# EAGLE design MT7687_Breakout (EAGLE 7.6.0)
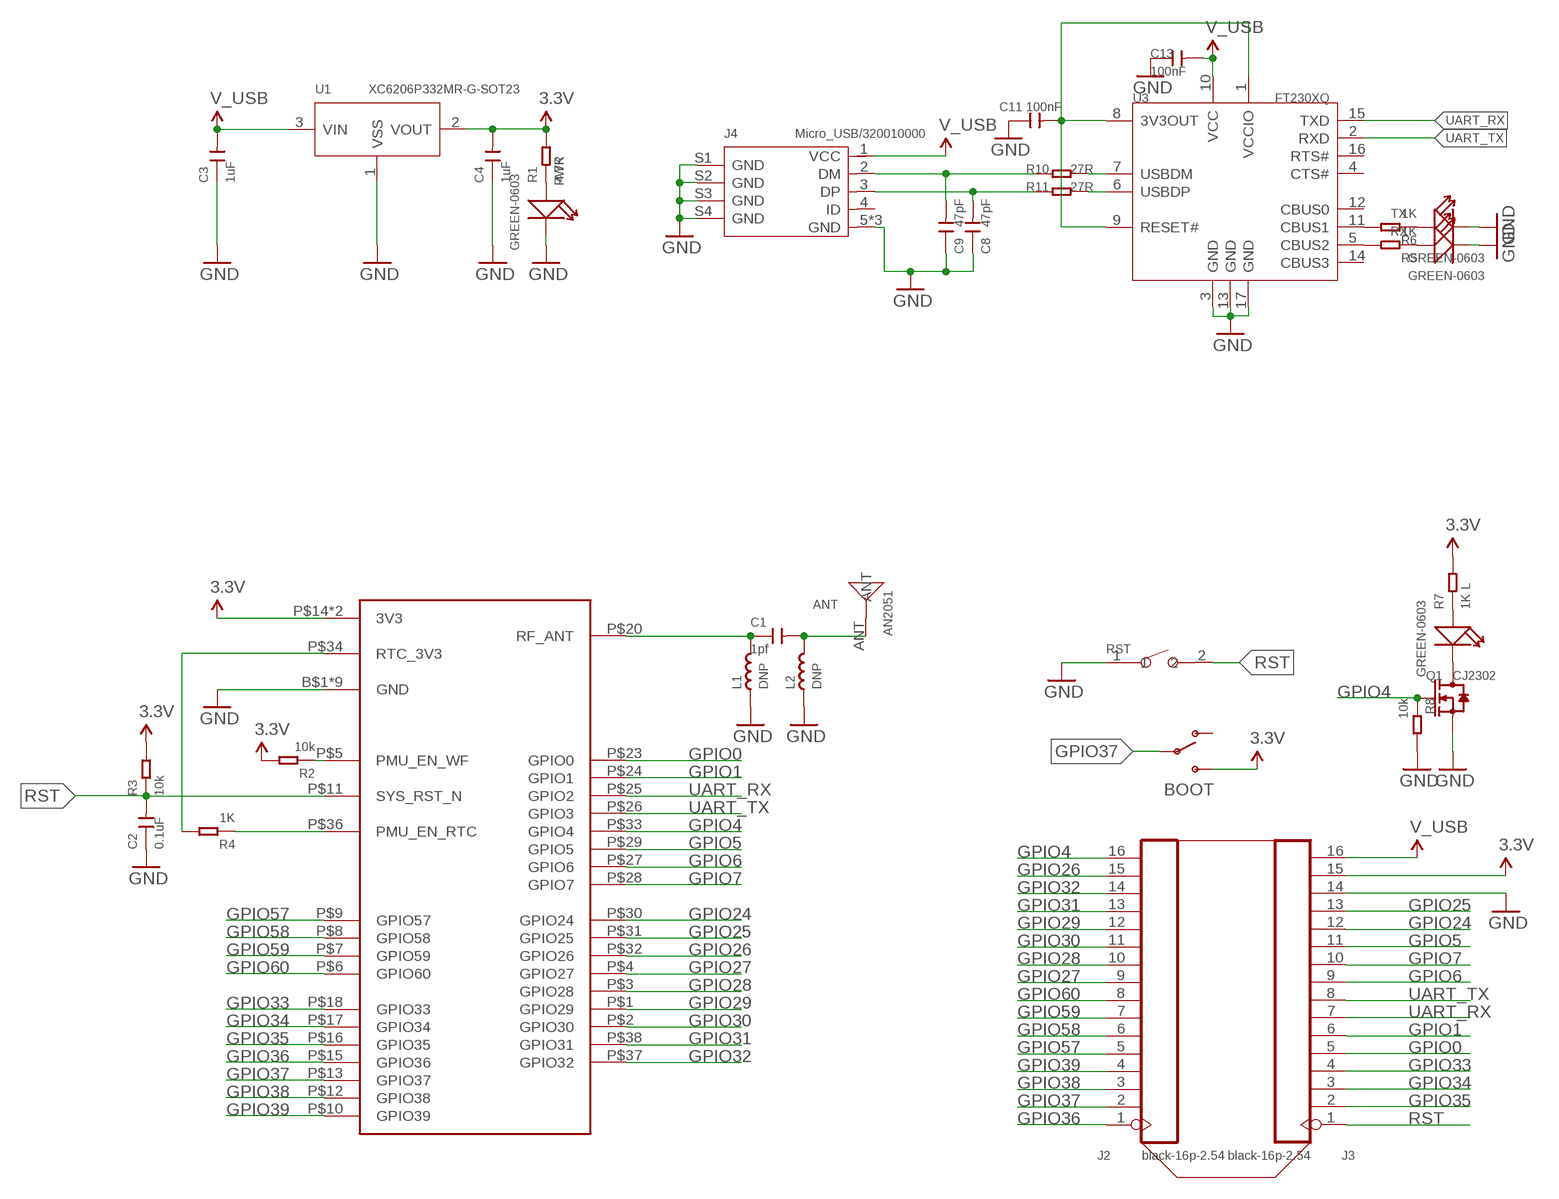
[diagram p0: schematic, sheet 1]

## Parts
ANT  AN2051  ANTENNA-AN2051-2.4G  [ANT-SMD2P-5.05X2X1.07MM]
BOOT  SWITCH-SPDTSMD  [AYZ0202]
C1  1pf  CERAMIC-1PF-50V-0.1PF-NPO(0402)  [C0402]
C2  0.1uF  CAP-0402  [C0402]
C3  1uF  CAP-0402  [C0402]
C4  1uF  CAP-0402  [C0402]
C8  47pF  CAP-0402  [C0402]
C9  47pF  CAP-0402  [C0402]
C11  100nF  CAP-0402  [C0402]
C13  100nF  CAP-0402  [C0402]
J2  black-16p-2.54  DIP-BLACK-FEMALE-HEADER-VERT(16P-2.54)  [H16-2.54]
J3  black-16p-2.54  DIP-BLACK-FEMALE-HEADER-VERT(16P-2.54)  [H16-2.54]
J4  Micro_USB/320010000  USB-MICRO-5P'5+4P'  [5+4P-SMD-0.65-B]
L  GREEN-0603  SMD-LED-CLEAR-GREEN(0603)  [LED-0603]
L1  DNP  INDUCTOR/FERRITE-BEAD'0402'  [L0402]
L2  DNP  INDUCTOR/FERRITE-BEAD'0402'  [L0402]
PWR  GREEN-0603  SMD-LED-CLEAR-GREEN(0603)  [LED-0603]
Q1  CJ2302  SMD-MOSFET-N-CH-20V-2.1A-CJ2302(SOT-23)  [SOT-23]
R1  4.7K  RES-0402  [R0402]
R2  10k  RES-0402  [R0402]
R3  10k  RES-0402  [R0402]
R4  1K  RES-0402  [R0402]
R5  1K  RES-0402  [R0402]
R6  1K  RES-0402  [R0402]
R7  1K  RES-0402  [R0402]
R8  10k  RES-0402  [R0402]
R10  27R  RES-0402  [R0402]
R11  27R  RES-0402  [R0402]
RST  SMD-BUTTON(2P-6.0X3.0X2.5MM)-DHT-1163S  [SW2-4.0-6.0X3.0X2.5MM]
RX  GREEN-0603  SMD-LED-CLEAR-GREEN(0603)  [LED-0603]
TX  GREEN-0603  SMD-LED-CLEAR-GREEN(0603)  [LED-0603]
U1  XC6206P332MR-G-SOT23  PMIC-LDO-XC6206P332MR-G(SOT23)  [SOT-23]
U3  FT230XQ  [QFN-16]
U$1  MT7687  [MT7687]

## Nets
3.3V: BOOT.3(S) C4.2 J3.15 R1.2 R2.2 R3.2 R7.2 U1.2(VOUT) U$1.P$14(3V3) U$1.P$39(3V3)
GND: C2.1 C3.1 C4.1 C8.1 C9.1 C11.1 C13.1 J3.14 J4.5(GND) J4.S1(GND) J4.S2(GND) J4.S3(GND) J4.S4(GND) J4.S5(GND) J4.S6(GND) L1.1 L2.1 PWR.- Q1.2(S) R8.2 RST.1 RX.- TX.- U1.1(VSS) U3.3(GND) U3.13(GND) U3.17(GND) U$1.B$1(GND) U$1.B$2(GND) U$1.B$3(GND) U$1.B$4(GND) U$1.P$19(GND) U$1.P$21(GND) U$1.P$22(GND) U$1.P$35(GND) U$1.P$40(GND)
GPIO0: J3.5 U$1.P$23(GPIO0)
GPIO1: J3.6 U$1.P$24(GPIO1)
GPIO4: J2.16 Q1.1(G) R8.1 U$1.P$33(GPIO4)
GPIO5: J3.11 U$1.P$29(GPIO5)
GPIO6: J3.9 U$1.P$27(GPIO6)
GPIO7: J3.10 U$1.P$28(GPIO7)
GPIO24: J3.12 U$1.P$30(GPIO24)
GPIO25: J3.13 U$1.P$31(GPIO25)
GPIO26: J2.15 U$1.P$32(GPIO26)
GPIO27: J2.9 U$1.P$4(GPIO27)
GPIO28: J2.10 U$1.P$3(GPIO28)
GPIO29: J2.12 U$1.P$1(GPIO29)
GPIO30: J2.11 U$1.P$2(GPIO30)
GPIO31: J2.13 U$1.P$38(GPIO31)
GPIO32: J2.14 U$1.P$37(GPIO32)
GPIO33: J3.4 U$1.P$18(GPIO33)
GPIO34: J3.3 U$1.P$17(GPIO34)
GPIO35: J3.2 U$1.P$16(GPIO35)
GPIO36: J2.1 U$1.P$15(GPIO36)
GPIO37: BOOT.2(P) J2.2 U$1.P$13(GPIO37)
GPIO38: J2.3 U$1.P$12(GPIO38)
GPIO39: J2.4 U$1.P$10(GPIO39)
GPIO57: J2.5 U$1.P$9(GPIO57)
GPIO58: J2.6 U$1.P$8(GPIO58)
GPIO59: J2.7 U$1.P$7(GPIO59)
GPIO60: J2.8 U$1.P$6(GPIO60)
N$1: R2.1 U$1.P$5(PMU_EN_WF)
N$2: C1.1 L1.2 U$1.P$20(RF_ANT)
N$3: ANT.ANT C1.2 L2.2
N$4: PWR.+ R1.1
N$5: R4.1 U$1.P$36(PMU_EN_RTC)
N$6: L.+ R7.1
N$7: C11.2 U3.1(VCCIO) U3.8(3V3OUT) U3.9(RESET#)
N$8: L.- Q1.3(D)
N$9: R4.2 U$1.P$34(RTC_3V3)
N$10: R10.2 U3.7(USBDM)
N$12: R11.2 U3.6(USBDP)
N$15: C9.2 J4.2(DM) R10.1
N$16: C8.2 J4.3(DP) R11.1
N$36: R5.1 RX.+
N$37: R6.1 TX.+
N$38: R5.2 U3.5(CBUS2)
N$39: R6.2 U3.11(CBUS1)
RST: C2.2 J3.1 R3.1 RST.2 U$1.P$11(SYS_RST_N)
UART_RX: J3.7 U3.15(TXD) U$1.P$25(GPIO2)
UART_TX: J3.8 U3.2(RXD) U$1.P$26(GPIO3)
V_USB: C3.2 C13.2 J3.16 J4.1(VCC) U1.3(VIN) U3.10(VCC)
Unconnected: BOOT.1(O) J4.4(ID) U3.4(CTS#) U3.12(CBUS0) U3.14(CBUS3) U3.16(RTS#)

## Library data of the parts
ANT = Seeed-OPL-Antenna:ANTENNA-AN2051-2.4G: 318010003; MPN: AN2051
BOOT = SparkFun-Electromechanical:SWITCH-SPDT: SPDT Switch Simple slide switch, Spark Fun Electronics SKU : COM-00102 DPDT SMT slide switch, AYZ0202, SWCH-08179; PROD_ID: SWCH-08179; SF_ID: COM-00597
C1 = Seeed-OPL-Capacitor:CERAMIC-1PF-50V-0.1PF-NPO(0402): 302010021; MPN: CC0402BRNPO9BN1R0
C2-C4 = Discrete:CAP: Ceramic Capacitors
C8 C9 C11 C13 = Discrete-new:CAP: Ceramic Capacitors
J2 J3 = Seeed-OPL-Connector:DIP-BLACK-FEMALE-HEADER-VERT(16P-2.54): 320030078; MPN: F185-1116A0BSYA1
J4 = Connector-new:USB-MICRO-5P: 5+4P-SMD-0.65-B:320010000;5+2P-SMD-0.65-AB:340032001
L PWR RX TX = Seeed-OPL-Diode:SMD-LED-CLEAR-GREEN(0603): 304090043; MPN: 19-217-G7C-AN1P2-3T
L1 L2 = Seeed-OPL-Inductor:INDUCTOR/FERRITE-BEAD
Q1 = Seeed-OPL-Transistor:SMD-MOSFET-N-CH-20V-2.1A-CJ2302(SOT-23): 305030015; MPN: CJ2302
R1-R8 = Seeed-OPL-Resistor:RES
R10 R11 = Discrete-new:RES
RST = Seeed-OPL-Switch:SMD-BUTTON(2P-6.0X3.0X2.5MM): 311020029
U1 = Seeed-OPL-ic:PMIC-LDO-XC6206P332MR-G(SOT23): 310030099; MPN: XC6206P332MR-G
U3 = template:FT230XQ: FT230X USB TO BASIC UART IC
U$1 = Seeed-OPL-ic:MT7687

## Board
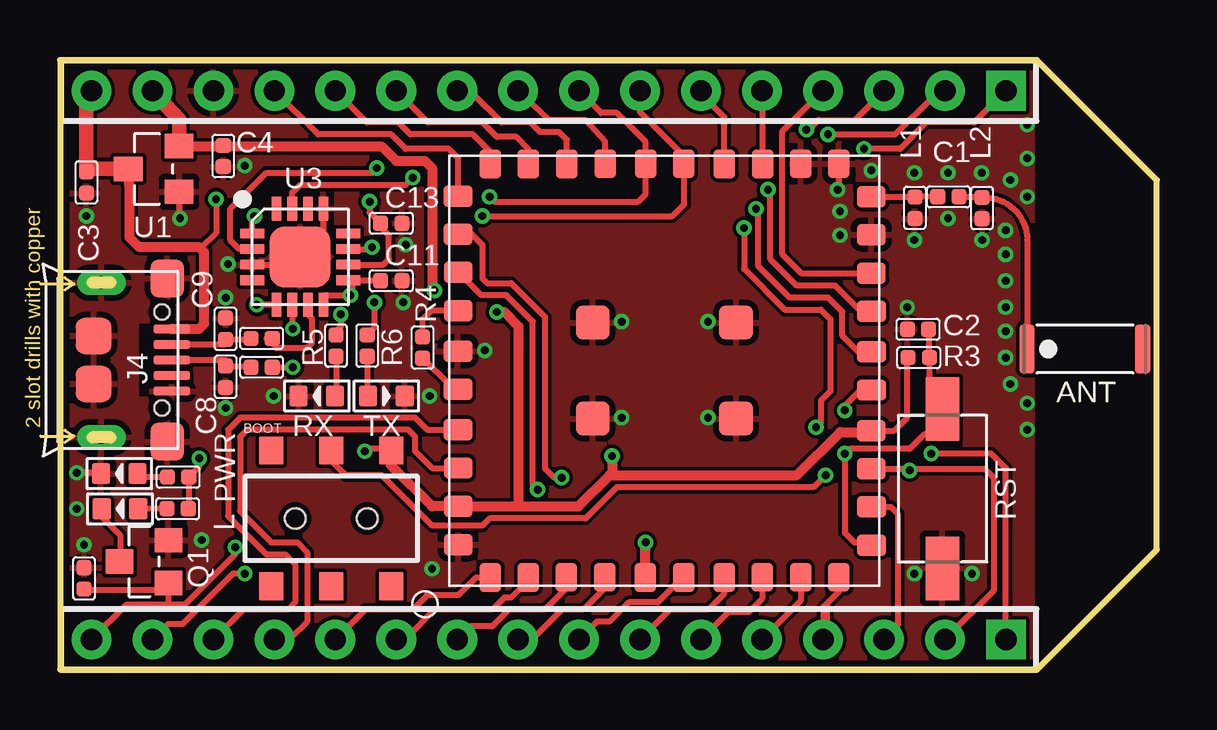
[diagram p1: board, top side]
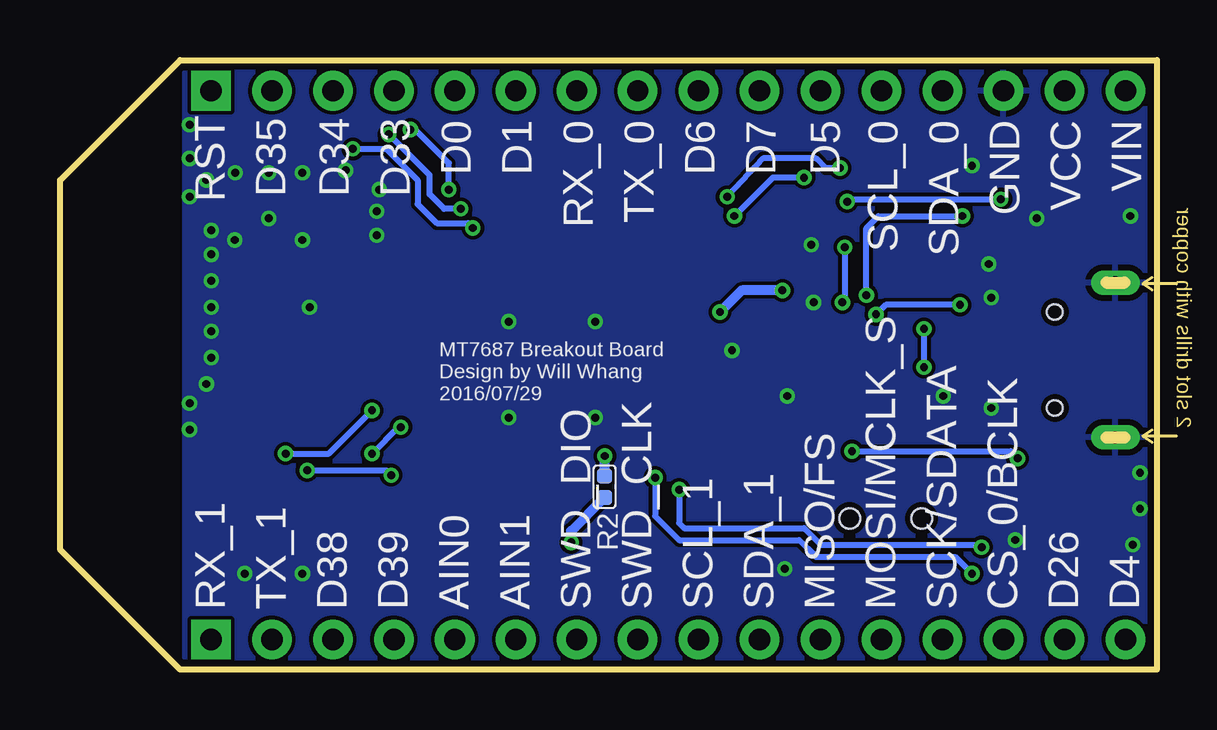
[diagram p2: board, bottom side, seen from below]

Size 45.7 x 25.4 mm. Coordinates in mm from the lower left corner, seen from the top.
Outline: 40.68,25.22 40.68,25.26
Outline: 0,0 40.7,0 45.7,5 45.7,20.4 40.7,25.4 0,25.4 0,0
Copper layers (1*16): Top 0.035mm / dielectric 1.5mm / Bottom 0.035mm
Design rules "SeeedStudio_2layer_DRU_no_angle_20140221": minimum track width 6mil, minimum drill 12mil, track to track 6mil, track to pad 6mil, pad to pad 6mil, via to via 6mil, smd to smd 0mil, copper to edge 10mil, drill to drill 10mil, minimum pad ring 10mil, minimum via ring 6mil, stop-mask expansion 2mil, vias tented up to drill 100mil, thermal gap 10mil

### Footprints (pad centres in the part's own frame; a part is rotated, then mirrored left to right if it is on the bottom)
ANT-SMD2P-5.05X2X1.07MM = smd 2.032 x 0.635: ANT 0,2.413; P$1 0,-2.413
AYZ0202 = smd 1 x 1.15: 1 -2.5,2.825; 2 0,2.825; 3 2.5,2.825; 4 -2.5,-2.825; 5 0,-2.825; 6 2.5,-2.825 | hole 0.85: 1.5,0; -1.5,0
C0402 = smd 0.635 x 0.635: 1 0,0.445; 2 0,-0.445
C0402' = smd 0.635 x 0.635: 1 -0.445,0; 2 0.445,0
H16-2.54 = drill 0.889 pad 1.651 square: 1 0,-19.05 | drill 0.889 pad 1.651: 2 0,-16.51; 3 0,-13.97; 4 0,-11.43; 5 0,-8.89; 6 0,-6.35; 7 0,-3.81; 8 0,-1.27; 9 0,1.27; 10 0,3.81; 11 0,6.35; 12 0,8.89; 13 0,11.43; 14 0,13.97; 15 0,16.51; 16 0,19.05
5+4P-SMD-0.65-B = smd 0.381 x 1.524: 1 -1.3,-0.25; 2 -0.65,-0.25; 3 0,-0.25; 4 0.65,-0.25; 5 1.3,-0.25 | smd 1.6 x 1.397: S1 -3.4,-0.427; S6 3.4,-0.427 | drill 0.508 pad 1.016 long: S2 -3.226,-3.175; S5 3.226,-3.175 | smd 1.5 x 1.5: S3 -1,-3.5; S4 1,-3.5 | hole 0.635: -2,-0.65; 2,-0.65
LED-0603 = smd 0.762 x 0.889: + -0.762,0; - 0.762,0
L0402 = smd 0.635 x 0.635: 1 -0.445,0; 2 0.445,0
SOT-23 = smd 1.016 x 1.143: 1 -0.889,-1.016; 2 0.889,-1.016; 3 0,1.016
R0402 = smd 0.635 x 0.635: 1 0,0.445; 2 0,-0.445
SW2-4.0-6.0X3.0X2.5MM = smd 2.65 x 1.4: 1 -3.325,0; 2 3.325,0
SOT-23' = smd 1.016 x 1.2: 1 -0.95,-1.06; 2 0.95,-1.06; 3 0,1.06
QFN-16 = smd 1 x 0.4: 1 -2,0.975; 2 -2,0.325; 3 -2,-0.325; 4 -2,-0.975; 9 2,-0.975; 10 2,-0.325; 11 2,0.325; 12 2,0.975 | smd 0.4 x 1: 5 -0.975,-2; 6 -0.325,-2; 7 0.325,-2; 8 0.975,-2; 13 0.975,2; 14 0.325,2; 15 -0.325,2; 16 -0.975,2 | smd 2.54 x 2.54: 17 0,0
MT7687 = smd 1.4 x 1.4: B$1 2.07,3.04; B$2 -1.93,3.04; B$3 -1.93,-2.93; B$4 2.07,-2.93 | smd 1.2 x 0.9: P$1 8.69,-7.2; P$2 8.69,-5.61; P$3 8.68,-4.03; P$4 8.68,-2.43; P$5 8.69,-0.74; P$6 8.69,0.85; P$7 8.69,2.54; P$8 8.68,4.13; P$9 8.68,5.73; P$10 8.68,7.32; P$21 -8.55,7.32; P$22 -8.55,5.73; P$23 -8.54,4.15; P$24 -8.54,2.55; P$25 -8.55,0.86; P$26 -8.55,-0.73; P$27 -8.55,-2.42; P$28 -8.54,-4.01; P$29 -8.54,-5.61; P$30 -8.54,-7.2 | smd 0.9 x 1.2: P$11 7.34,8.68; P$12 5.75,8.68; P$13 4.17,8.67; P$14 2.57,8.67; P$15 0.88,8.68; P$16 -0.71,8.68; P$17 -2.4,8.68; P$18 -3.99,8.67; P$19 -5.59,8.67; P$20 -7.18,8.67; P$31 -7.2,-8.55; P$32 -5.61,-8.55; P$33 -4.03,-8.54; P$34 -2.43,-8.54; P$35 -0.74,-8.55; P$36 0.85,-8.55; P$37 2.54,-8.55; P$38 4.13,-8.54; P$39 5.73,-8.54; P$40 7.32,-8.54

### Placement (x,y rotation side)
ANT  42.7,13.36 90 top
BOOT  11.3,6.3 0 top
C1  37.02,19.7 90 top
C2  0.1uF  [C0402']  35.75,14.18 0 top
C3  1uF  [C0402']  1.1,20.3 90 top
C4  1uF  [C0402']  6.8,21.4 90 top
C8  6.9,12.2 180 top
C9  6.9,14.2 0 top
C11  13.8,16.2 270 top
C13  13.8,18.6 270 top
J2  20.36,1.26 90 top
J3  20.36,24.12 90 top
J4  4.9,12.9 270 top
L  2.5,6.7 180 top
L1  35.62,19.24 90 top
L2  38.42,19.23 90 top
PWR  2.47,8.17 180 top
Q1  3.5,4.5 90 top
R1  4.92,8.02 90 top
R2  23.01,7.62 180 bottom
R3  35.78,13 270 top
R4  15.11,13.42 180 top
R5  11.5,13.5 180 top
R6  12.8,13.5 180 top
R7  4.9,6.7 90 top
R8  1,3.8 180 top
R10  8.4,13.8 90 top
R11  8.4,12.6 90 top
RST  36.77,7.54 90 top
RX  10.7,11.4 180 top
TX  13.6,11.4 0 top
U1  XC6206P332MR-G-SOT23  [SOT-23']  3.9,20.86 90 top
U3  10,17.2 0 top
U$1  25.13,12.53 270 top

### Tracks (layer width: path | path; a pad name or v marks a point on that pad's centre or on a via)
3.3V  (via drill 0.33)
  Top 0.254: U$1.P$14 34.76,9.96 35.3,10.5 35.3,12.96 R3.2 | 13.8,8.5 13.8,8.9 13.5,9.2 12.8,9.2 v12.7,9.1 | v5.8,8.8 5.8,8.46 R1.2 5.36,6.72 R7.2
  Top 0.406: 19.1,6.8 U$1.P$39 15.5,6.8 13.8,8.5 BOOT.3 13.94,9.26 | 19.1,6.8 21.6,6.8 22.9,8.1 23,8.1 | 23,8.1 30.7,8.1 32.5,9.9 33.74,9.9 U$1.P$14 | v23,8.9 23,8.1 | U1.2 6.67,21.81 C4.2 6.8,21.8 13.4,21.8 14,21.2 15.2,21.2 15.5,20.9 15.5,15.9 v15.6,15.8 | 19.1,6.8 19.1,14.3 18.5,14.9 v18.2,14.9
  Top 0.61: U1.2 4.96,22.91 J3.15
  Bottom 0.254: v12.7,9.1 6.1,9.1 v5.8,8.8
  Bottom 0.406: R2.2 23.01,8.79 v23,8.9 | v15.6,15.8 17.3,15.8 v18.2,14.9
GND  (via drill 0.33)
  Top 0.254: U3.3 9.68,16.88 U3.17 10.97,18.18 U3.13 | U$1.P$21 32.45,20.05 v32.4,20 | U1.1 4.96,18.84 v5,18.8 | PWR.- 1.61,8.21 v0.7,8.2
  other vias: 1.1,18.9 7.7,21 6.9,10.9 6.9,15.5 7,16.9 14.4,17.7 14.3,15.3 23.4,14.5 23.4,10.5 27,10.5 27,14.5 35.3,15.1 35.6,4 38,4 35.6,17.9 38.42,17.9 32.5,18.1 17.7,13.3 15.5,4.2 15.4,11.4 8.9,11.4 37,18.8 39.4,17.3 39.4,16.2 39.4,15.1 39.4,14.1 39.4,13 39.6,11.9 40.3,11.1 40.3,10 33.8,20.8 32.5,19.1 35.6,20.7 37,20.7 38.4,20.7 39.6,20.4 40.3,19.7 39.4,18.3 40.3,21.3 40.3,22.7 0.7,6.7 1,5.2 5.9,5.4
  pour Bottom: 0,25.4 40.5,25.4 40.5,-0.1 0,-0.1
  pour Top: 0,25.4 0,-0.1 40.5,-0.1 40.5,25.4
GPIO0
  Top 0.254: U$1.P$23 29.28,24.09 J3.5
GPIO1
  Top 0.254: U$1.P$24 27.68,23.02 26.8,23.9 26.8,24.03 J3.6
GPIO4  (via drill 0.33)
  Top 0.254: v19.9,7.5 19.7,7.7 19.7,14.5 18.6,15.6 17.55,15.6 U$1.P$33 | J2.16 2.75,2.7 4.5,2.7 | 4.5,2.7 5.2,2.7 7.3,4.8 v7.3,5.1 | R8.1 1.06,3.3 4.1,3.3 4.41,3.61 Q1.1 4.52,2.72 4.5,2.7
  Bottom 0.254: v19.9,7.5 19.9,6.1 19.7,5.9 14.7,5.9 14,5.2 7.4,5.2 v7.3,5.1
GPIO5
  Top 0.254: J3.11 15.33,22.8 17.6,22.8 18.2,22.2 19,22.2 19.52,21.68 19.5,21.66 19.5,21.1 U$1.P$29
GPIO6
  Top 0.254: J3.9 20.41,22.9 21.9,22.9 22.71,21.99 U$1.P$27
GPIO7
  Top 0.254: J3.10 16.67,24 17.2,24 18.4,22.8 19.6,22.8 20,22.4 20.8,22.4 21.12,22.08 U$1.P$28
GPIO24
  Top 0.254: J3.12 12.79,22.8 14.1,22.8 14.6,22.3 17.2,22.3 17.93,21.57 U$1.P$30
GPIO25
  Top 0.254: J3.13 10.75,22.3 13.8,22.3 14.4,21.7 16.2,21.7 16.58,21.32 U$1.P$31
GPIO26  (via drill 0.33)
  Top 0.254: v20.9,8 20.6,8 20.2,8.4 20.2,14.7 18.8,16.1 17.8,16.1 17.6,16.3 17.6,17.7 17.16,18.14 U$1.P$32 | 3.9,1.31 J2.15 4.49,1.9 5.1,1.9 7.2,4 v7.7,4
  Bottom 0.254: v20.9,8 20.9,6.4 19.9,5.4 14.9,5.4 14.2,4.7 8.4,4.7 v7.7,4
GPIO27
  Top 0.254: U$1.P$4 22.7,3.4 21.8,2.5 20.9,2.5 19.8,1.4 19.23,1.4 J2.9
GPIO28
  Top 0.254: U$1.P$3 21.1,3.4 20.2,2.5 18.7,2.5 18,1.8 17.09,1.8 J2.10
GPIO29
  Top 0.254: J2.12 12.71,2.5 14.7,2.5 15.3,3.1 16.6,3.1 17.34,3.84 U$1.P$1
GPIO30
  Top 0.254: J2.11 14.15,1.4 14.5,1.4 15.6,2.5 18,2.5 18.5,3 18.8,3 19.52,3.72 U$1.P$2
GPIO31
  Top 0.254: U$1.P$38 15.5,8.4 14.8,9.1 14.8,9.7 14.5,10 7.8,10 7.5,9.7 7.5,6.6 8.8,5.3 9.9,5.3 10.3,4.9 10.3,2 9.6,1.3 8.97,1.3 J2.13
GPIO32
  Top 0.254: U$1.P$37 15.31,9.99 14.8,10.5 7.5,10.5 7,10 7,6.4 8.6,4.8 9.4,4.8 9.8,4.4 9.8,2.8 9.5,2.5 7.63,2.5 J2.14
GPIO33
  Top 0.254: J3.4 30.1,22.43 30.1,17.3 30.88,16.52 U$1.P$18
GPIO34  (via drill 0.33)
  Top 0.254: v29.5,20 29.6,19.9 29.6,17.1 30.7,16 32.3,16 33.37,14.93 U$1.P$17 | v31.1,22.5 31.2,22.5 31.6,22.9 33.11,22.9 J3.3
  Bottom 0.254: v29.5,20 29.5,21.1 30.9,22.5 v31.1,22.5
GPIO35  (via drill 0.33)
  Top 0.254: v29,19.2 29.1,19.1 29.1,16.8 30.4,15.5 32,15.5 32.6,14.9 32.6,13.9 33.26,13.24 U$1.P$16 | v32,22.3 34.8,22.3 36.4,23.9 36.7,23.95 J3.2
  Bottom 0.254: v29,19.2 29.7,19.2 30.3,19.8 30.3,20.6 v32,22.3
GPIO36  (via drill 0.33)
  Top 0.254: U$1.P$15 34.15,11.65 34.2,11.6 33.3,11.6 32.7,11 v32.7,10.8 | J2.1 39.41,8.39 38.8,9 v36.3,9
  Bottom 0.254: v36.3,9 34.5,9 v32.7,10.8
GPIO37  (via drill 0.33)
  Top 0.254: BOOT.2 11.2,9.43 11.2,8.8 11.9,8.1 13.4,8.1 15.5,6 17.6,6 17.9,6.3 21.9,6.3 23.2,7.6 31.4,7.6 31.86,8.06 31.9,8.12 v31.9,8.1 | v35.4,8.3 35.34,8.36 U$1.P$13 38.54,8.36 38.9,8 38.9,3.29 J2.2
  Bottom 0.254: v35.4,8.3 32.1,8.3 v31.9,8.1
GPIO38
  Top 0.254: U$1.P$12 34.62,6.78 34.9,6.5 34.9,1.83 J2.3
GPIO39
  Top 0.152: 31.95,2.75 32,2.7 32,1.7 J2.4
  Top 0.254: U$1.P$10 32.45,3.25 31.95,2.75 31.8,2.6 J2.4
GPIO57
  Top 0.254: U$1.P$9 30.86,2.87 J2.5
GPIO58
  Top 0.254: U$1.P$8 29.26,2.96 28.7,2.4 27.85,2.4 J2.6
GPIO59
  Top 0.254: U$1.P$7 27.67,3.17 27,2.5 25.41,2.5 J2.7
GPIO60
  Top 0.254: U$1.P$6 25.94,3.84 24.9,2.8 23.7,2.8 22.9,2 22.37,2 J2.8
N$1  (via drill 0.33)
  Top 0.406: U$1.P$5 24.39,4.99 v24.4,5.3
  Bottom 0.406: v24.4,5.3 24.4,5.77 R2.1
N$2
  Top 0.254: C1.1 35.64,19.7 arc90 L1.2 33.83,19.68 arc-90 U$1.P$20
N$3
  Top 0.254: ANT.ANT arc90 40.3,13.37 40.3,17.9 arc90 38.53,19.67 L2.2 37.49,19.67 arc-90 C1.2
N$4
  Top 0.254: R1.1 3.28,8.02 PWR.+
N$5
  Top 0.254: U$1.P$36 16.42,11.68 15.7,12.4 15.69,12.4 R4.1
N$6
  Top 0.254: R7.1 L.+
N$7  (via drill 0.33)
  Top 0.254: C11.2 13.12,16.23 U3.9 12.2,16.02 12.2,15.6 v12.1,15.6 11.1,15.6 10.97,15.47 U3.8 | U3.1 8,18.9 v8.1,18.9
  Bottom 0.254: v12.1,15.6 12.1,18.4 11.6,18.9 v8.1,18.9
N$8
  Top 0.254: L.- 1.74,6.36 2.5,5.6 2.5,4.52 Q1.3
N$9
  Top 0.254: U$1.P$34 15.46,14.96 15.1,14.6 15.1,13.87 R4.2
N$10
  Top 0.254: R10.2 8.6,13.8 9,13.4 10.3,13.4 10.5,13.6 10.5,14.62 10.32,14.8 U3.7
N$12  (via drill 0.33)
  Top 0.254: R11.2 v9.7,12.6 | v9.7,14.2 9.7,15.18 U3.6
  Bottom 0.254: v9.7,12.6 v9.7,14.2
N$15
  Top 0.254: J4.2 6.9,13.55 C9.2 7.96,13.76 R10.1
N$16
  Top 0.254: J4.3 6.9,12.9 C8.2 7.96,12.64 R11.1
N$36
  Top 0.254: R5.1 11.5,11.44 RX.+
N$37
  Top 0.254: R6.1 12.8,11.44 TX.+
N$38  (via drill 0.33)
  Top 0.254: U3.5 v8.2,15.2 | v11.7,14.8 11.7,14.3 11.5,14.1 R5.2
  Bottom 0.254: v8.2,15.2 11.3,15.2 v11.7,14.8
N$39  (via drill 0.33)
  Top 0.254: U3.11 12.93,17.52 v13,17.6 | v13.1,15.3 13.1,14.24 R6.2
  Bottom 0.254: v13,17.6 13,15.4 v13.1,15.3
RST  (via drill 0.33)
  Top 0.254: C2.2 36.19,13.03 R3.1 36.22,11.41 RST.2 36.7,10.79 36.7,9.9 36.8,9.8 36,9.8 35.4,9.2 32.9,9.2 v32.7,9 32.7,5.7 33.1,5.3 33.7,5.3 U$1.P$11 33.89,5.19 34,5.3 | J3.1 38.1,22.8 36.1,22.8 35,21.7 v33.5,21.7 | v28.5,18.4 28.5,16.7 30.2,15 31.7,15 32.1,14.6 32.1,11.6 31.7,11.2 31.7,10.3 v31.5,10.1
  Bottom 0.254: v33.5,21.7 32.1,21.7 30.8,20.4 30.8,19.4 30,18.6 28.7,18.6 v28.5,18.4 | v31.5,10.1 31.6,10.1 v32.7,9
UART_RX  (via drill 0.33)
  Top 0.254: U3.15 9.68,19.88 10,20.2 14.4,20.2 v14.7,20.5 | v17.6,18.9 25.5,18.9 26,19.4 U$1.P$25 | 25.9,20.99 U$1.P$25 | J3.7 24.17,23.23 25.8,21.6 25.8,21.27 U$1.P$25
  Bottom 0.254: v14.7,20.5 16,20.5 v17.6,18.9
UART_TX  (via drill 0.33)
  Top 0.254: U3.2 7.47,17.52 7.1,17.9 7.1,19.2 8.6,20.7 13,20.7 v13.2,20.9 | v17.9,19.7 18.1,19.5 24.1,19.5 24.4,19.8 U$1.P$26 24.4,22 23.2,23.2 22.55,23.2 J3.8
  Bottom 0.254: v13.2,20.9 13.8,20.9 14.2,21.3 16.4,21.3 v17.9,19.7
V_USB  (via drill 0.33)
  Top 0.254: U3.10 13.47,16.88 13.7,17.1 13.7,18.1 13.4,18.4 C13.2 12.9,19.05 v12.9,19.5 | 5.85,17.55 6.5,18.2 v6.5,19.6
  Top 0.406: J4.1 5.8,14.2 6,14.4 6,17.4 5.85,17.55 5.8,17.6 3.3,17.6 2.9,18 2.9,20 U1.3
  Top 0.61: C3.2 1.11,20.86 U1.3 1.14,20.86 1.1,20.8 1.1,23.91 J3.16
  Bottom 0.254: v12.9,19.5 12.7,19.6 v6.5,19.6

### Text on the board
bNames: VIN | VCC | GND | SDA_0 | SCL_0 | D5 | D7 | D6 | TX_0 | RX_0 | D1 | D0 | D33 | D34 | D35 | RST | MT7687 Breakout Board / Design by Will Whang / 2016/07/29 | D4 | D26 | CS_0/BCLK | SCK/SDATA | MOSI/MCLK_S | MISO/FS | SDA_1 | SCL_1 | SWD_CLK | SWD_DIO | AIN1 | AIN0 | D39 | D38 | TX_1 | RX_1